# EAGLE design Stepper Motor Driver (EAGLE 6.4)
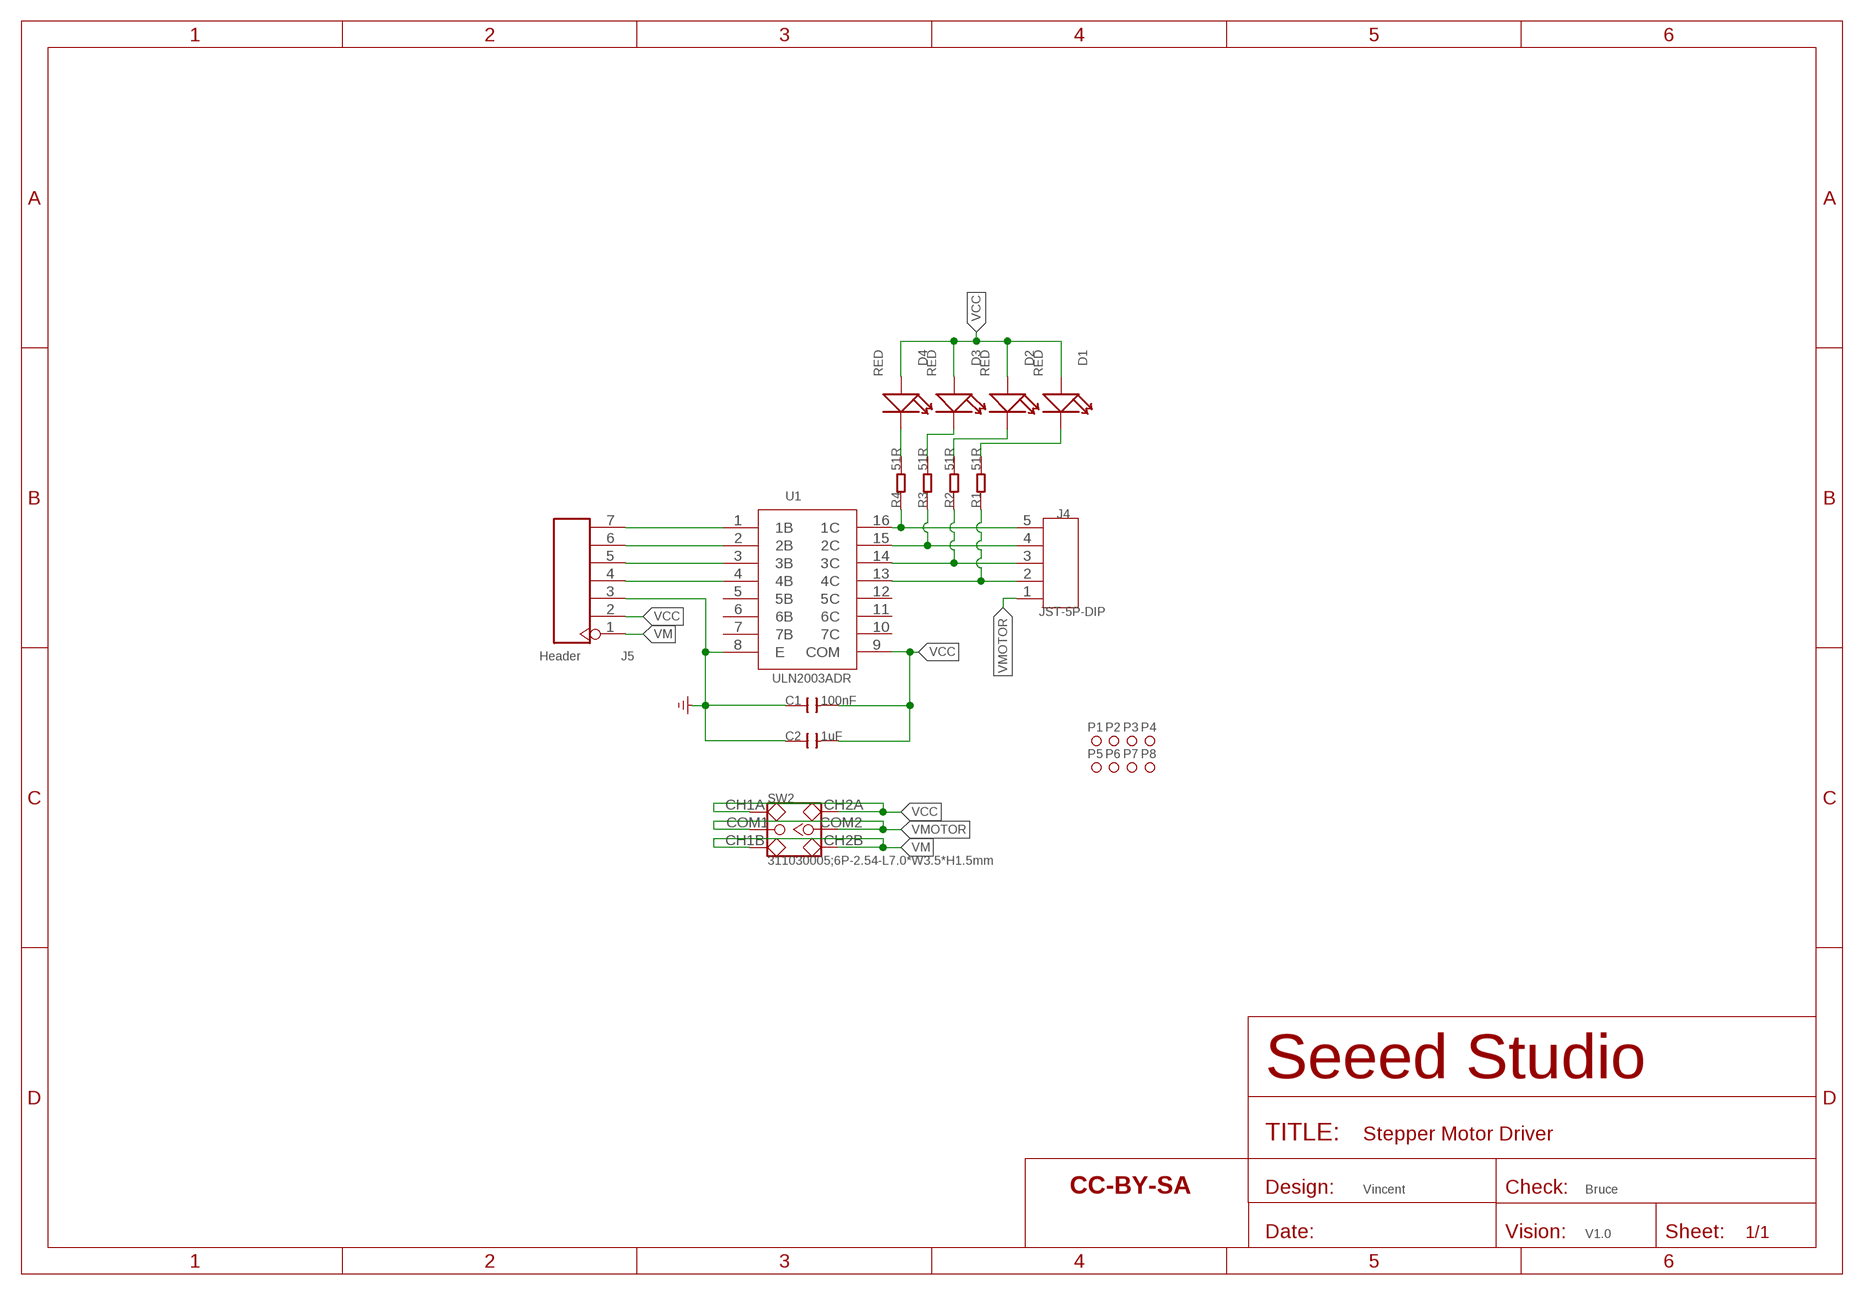
[diagram p0: schematic, sheet 1]

## Parts
C1  100nF  CAP-0603  [C0603]
C2  1uF  CAP-0603  [C0603]
D1  RED  LED'0603'  [LED-0603]
D2  RED  LED'0603'  [LED-0603]
D3  RED  LED'0603'  [LED-0603]
D4  RED  LED'0603'  [LED-0603]
J4  JST-5P-DIP  [JST5-2.54]
J5  Header  HEADER-7P  [H7-2.54]
P1  MARK-1.0'ANNULAR'  [ROUND-MARK-1.0]
P2  MARK-1.0'ANNULAR'  [ROUND-MARK-1.0]
P3  MARK-1.0'ANNULAR'  [ROUND-MARK-1.0]
P4  MARK-1.0'ANNULAR'  [ROUND-MARK-1.0]
P5  MARK-1.0'ANNULAR'  [ROUND-MARK-1.0]
P6  MARK-1.0'ANNULAR'  [ROUND-MARK-1.0]
P7  MARK-1.0'ANNULAR'  [ROUND-MARK-1.0]
P8  MARK-1.0'ANNULAR'  [ROUND-MARK-1.0]
R1  51R  RES-0603  [R0603]
R2  51R  RES-0603  [R0603]
R3  51R  RES-0603  [R0603]
R4  51R  RES-0603  [R0603]
SW2  311030005;6P-2.54-L7.0*W3.5*H1.5mm  SWITCH-2CH-6P-SMD  [SW6-2.54-SMD-7.0X3.5X1.5MM]
U1  ULN2003ADR  TRANSISTOR-ULN2003ADR  [SOIC16-1.27-10X3.9MM]
U$1  SEEEDSTUDIO-OPEN-SCH-FRAME  [SEEEDSTUDIO-PCB-FRAME]

## Nets
GND: C1.1 C2.1 J5.3 U1.8(E) ; supply symbol labelled GND_POWER
N$1: J4.4 R3.2 U1.15(2C)
N$2: J4.3 R2.2 U1.14(3C)
N$3: J5.4 U1.4(4B)
N$4: D4.- R4.1
N$5: J5.7 U1.1(1B)
N$6: J5.6 U1.2(2B)
N$7: J5.5 U1.3(3B)
N$9: D3.- R3.1
N$11: J4.5 R4.2 U1.16(1C)
N$12: D2.- R2.1
N$13: D1.- R1.1
N$14: J4.2 R1.2 U1.13(4C)
VCC: C1.2 C2.2 D1.+ D2.+ D3.+ D4.+ J5.2 SW2.CH1A SW2.CH2A U1.9(COM)
VM: J5.1 SW2.CH1B SW2.CH2B
VMOTOR: J4.1 SW2.COM1 SW2.COM2
Unconnected: U1.5(5B) U1.6(6B) U1.7(7B) U1.10(7C) U1.11(6C) U1.12(5C)

## Notes on the sheet
- Vincent | Bruce
- V1.0

## Library data of the parts
C1 C2 = Discrete-new:CAP: Ceramic Capacitors
D1-D4 = Discrete-new:LED
J4 = Connector-new:JST-5P-DIP
J5 = Connector-new:HEADER-7P
P1-P8 = Discrete-new:MARK-1.0; PARTNO: DNP
R1-R4 = Discrete-new:RES
SW2 = Discrete-new:SWITCH-2CH-6P: SW6-2.54-9.0X3.5X3.2+2.0MM:311010004;SW6-2.54-9.0X3.5X3.2-90D:311030004;SW6-2.54-SMD-7.0X3.5X1.5MM:311030005
U1 = IC-new:TRANSISTOR-ULN2003ADR: TRANSISTOR ARRAYS
U$1 = moudle-new:SEEEDSTUDIO-OPEN-SCH-FRAME

## Board
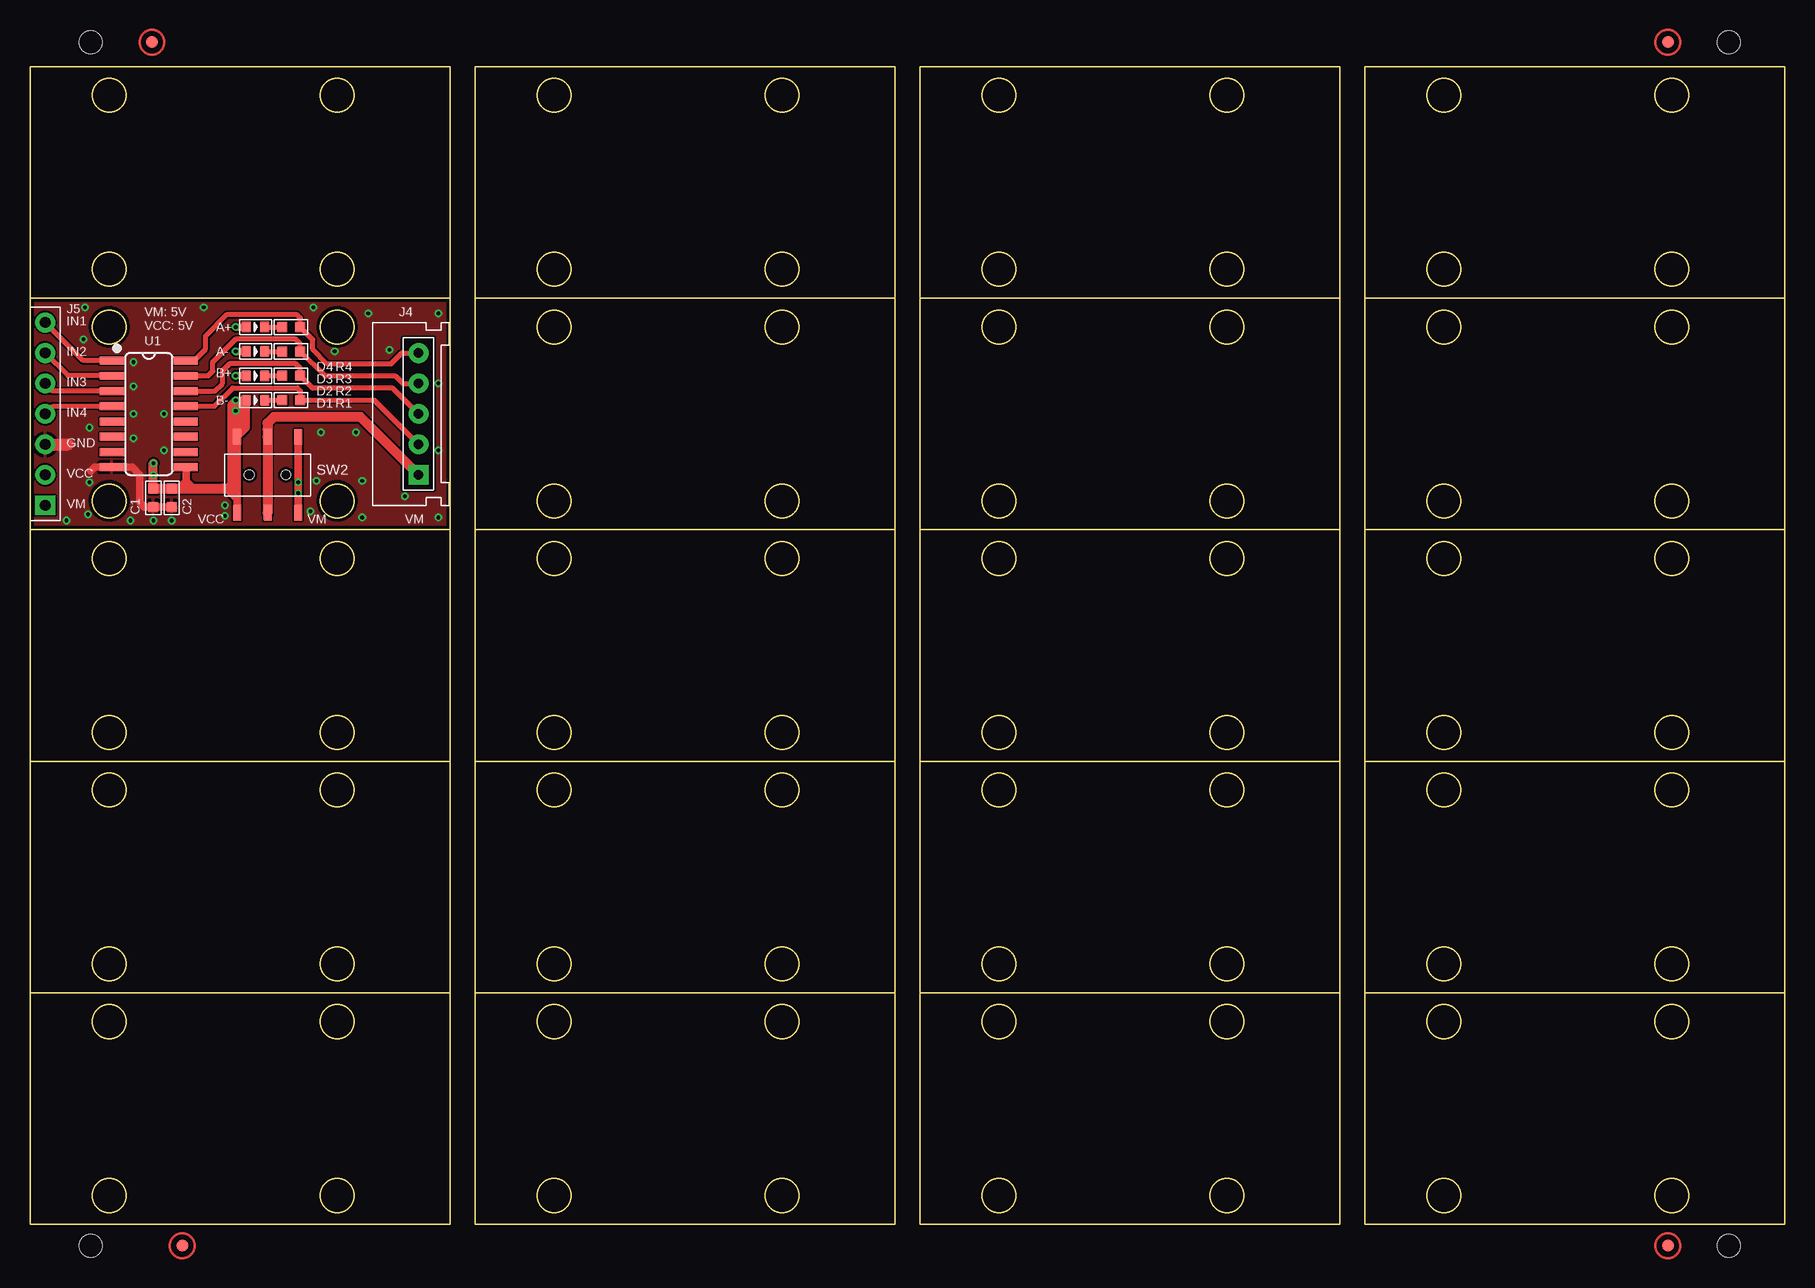
[diagram p1: board, top side]
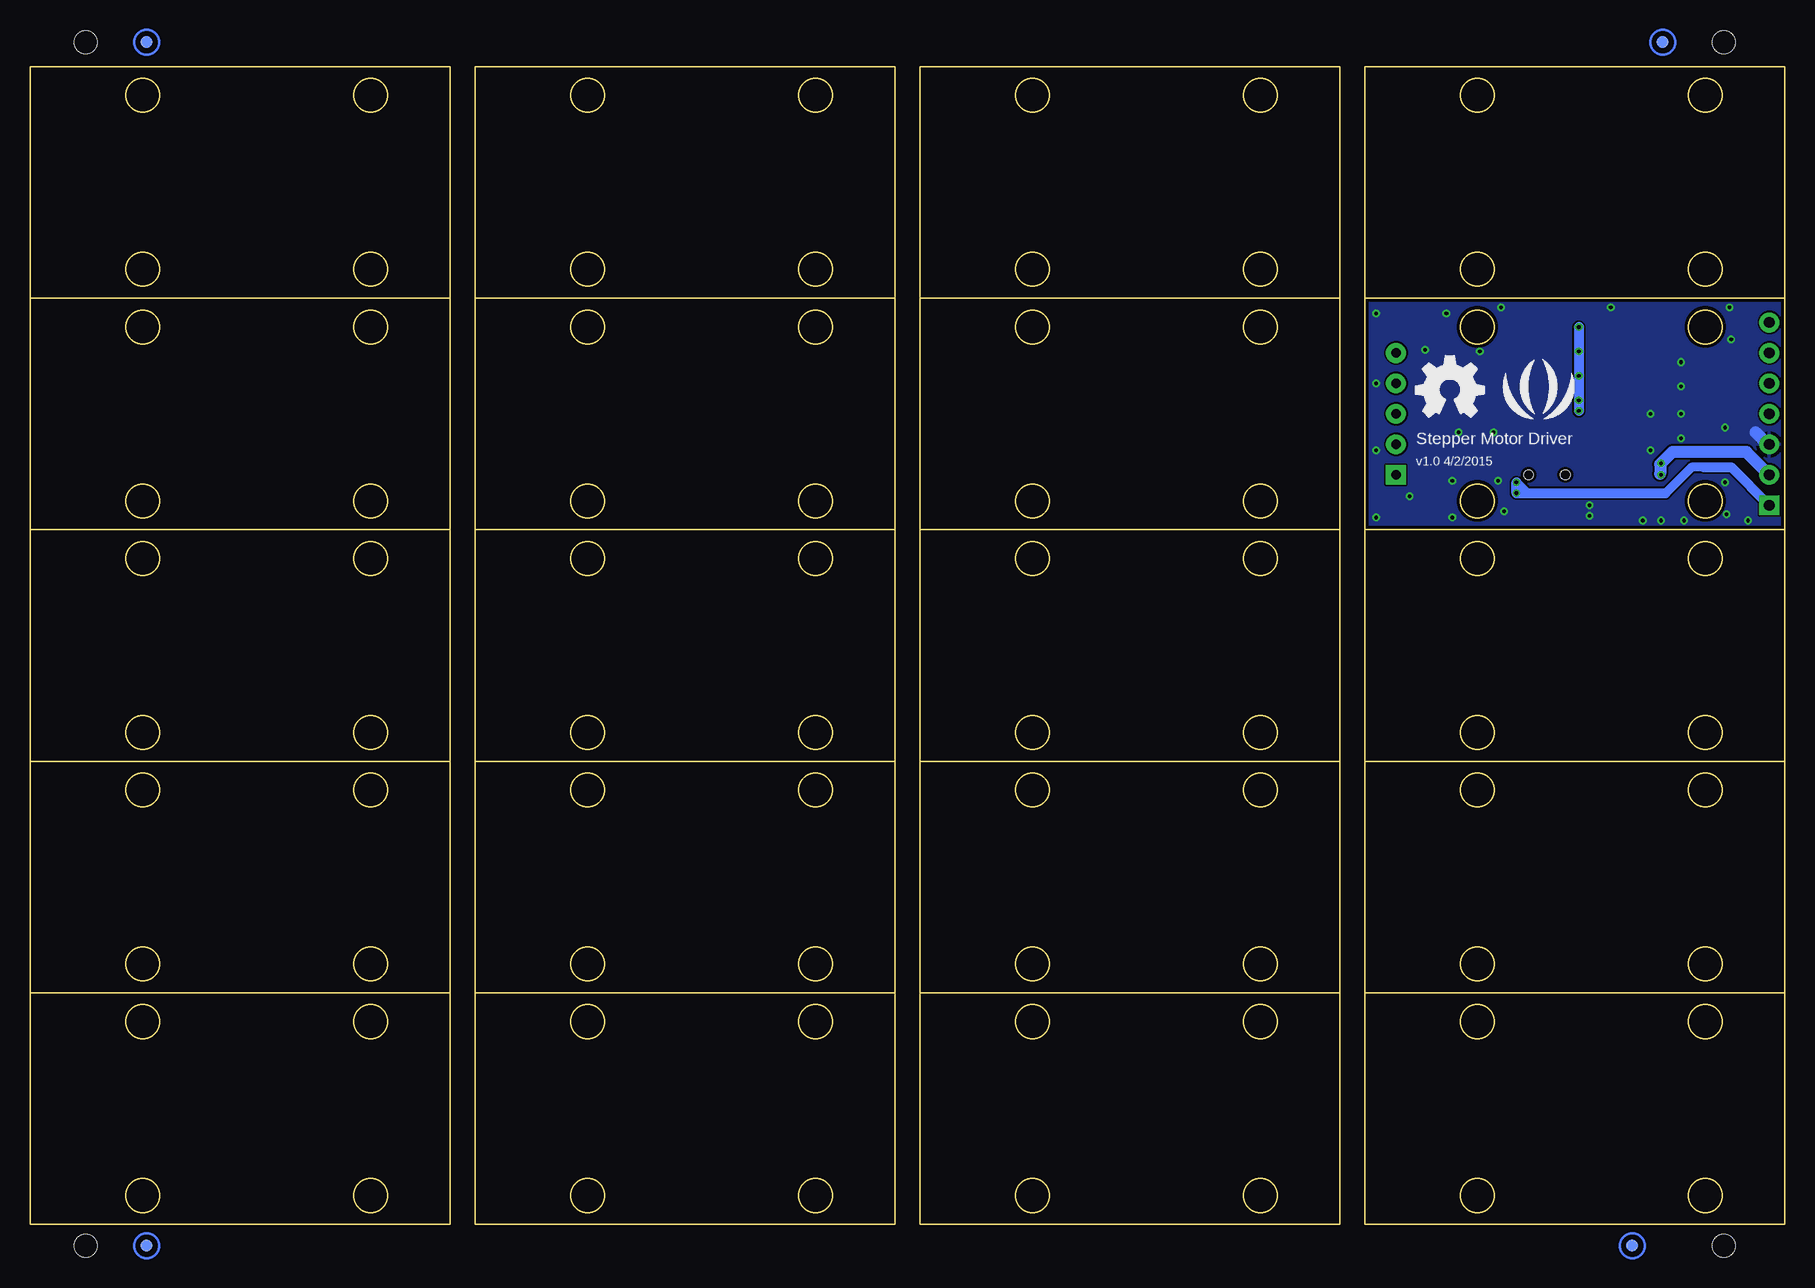
[diagram p2: board, bottom side, seen from below]

Size 146.25 x 96.52 mm. Coordinates in mm from the lower left corner, seen from the top.
Outline: 146.25,38.61 146.25,57.91 111.25,57.91 111.25,38.61 146.25,38.61
Outline: 146.25,38.6 111.25,38.6 111.25,19.3 146.25,19.3 146.25,38.6
Outline: 146.25,38.6 146.25,38.61
Outline: 35,96.52 0,96.52
Outline: 72.08,96.52 37.08,96.52
Outline: 109.17,96.52 74.17,96.52
Outline: 111.25,96.52 146.25,96.52 146.25,96.52
Outline: 146.25,96.52 111.25,96.52 111.25,77.22 146.25,77.22 146.25,96.52
Outline: 0,57.91 0,77.21 35,77.21 35,57.91 0,57.91
Outline: 0,38.61 0,57.91 35,57.91 35,38.61 0,38.61
Outline: 37.08,57.91 37.08,77.21 72.08,77.21 72.08,57.91 37.08,57.91
Outline: 37.08,38.61 37.08,57.91 72.08,57.91 72.08,38.61 37.08,38.61
Outline: 74.17,57.91 74.17,77.21 109.17,77.21 109.17,57.91 74.17,57.91
Outline: 74.17,38.61 74.17,57.91 109.17,57.91 109.17,38.61 74.17,38.61
Outline: 111.25,57.91 111.25,77.21 146.25,77.21 146.25,57.91 111.25,57.91
Outline: 0,19.3 0,38.6 35,38.6 35,19.3 0,19.3
Outline: 0,0 0,19.3 35,19.3 35,0 0,0
Outline: 37.08,19.3 37.08,38.6 72.08,38.6 72.08,19.3 37.08,19.3
Outline: 37.08,0 37.08,19.3 72.08,19.3 72.08,0 37.08,0
Outline: 74.17,19.3 74.17,38.6 109.17,38.6 109.17,19.3 74.17,19.3
Outline: 74.17,0 74.17,19.3 109.17,19.3 109.17,0 74.17,0
Outline: 111.25,0 111.25,19.3 146.25,19.3 146.25,0 111.25,0
Outline: 0,77.22 0,96.52 35,96.52 35,77.22 0,77.22
Outline: 37.08,77.22 37.08,96.52 72.08,96.52 72.08,77.22 37.08,77.22
Outline: 74.17,77.22 74.17,96.52 109.17,96.52 109.17,77.22 74.17,77.22
Outline: circle at 6.6,74.81 radius 1.4
Outline: circle at 25.6,74.81 radius 1.4
Outline: circle at 25.6,60.31 radius 1.4
Outline: circle at 6.6,60.31 radius 1.4
Outline: circle at 6.6,55.51 radius 1.4
Outline: circle at 25.6,55.51 radius 1.4
Outline: circle at 25.6,41.01 radius 1.4
Outline: circle at 6.6,41.01 radius 1.4
Outline: circle at 43.68,74.81 radius 1.4
Outline: circle at 62.68,74.81 radius 1.4
Outline: circle at 62.68,60.31 radius 1.4
Outline: circle at 43.68,60.31 radius 1.4
Outline: circle at 43.68,55.51 radius 1.4
Outline: circle at 62.68,55.51 radius 1.4
Outline: circle at 62.68,41.01 radius 1.4
Outline: circle at 43.68,41.01 radius 1.4
Outline: circle at 80.77,74.81 radius 1.4
Outline: circle at 99.77,74.81 radius 1.4
Outline: circle at 99.77,60.31 radius 1.4
Outline: circle at 80.77,60.31 radius 1.4
Copper layers (1*16): Top 0.035mm / dielectric 1.5mm / Bottom 0.035mm
Design rules "SeeedStudio_2layer_DRU_no_angle_20140221 *": minimum track width 1mil, minimum drill 12mil, track to track 6mil, track to pad 10mil, pad to pad 10mil, via to via 6mil, smd to smd 0mil, copper to edge 10mil, drill to drill 10mil, minimum pad ring 10mil, minimum via ring 6mil, stop-mask expansion 2mil, vias tented up to drill 25mil, thermal gap 10mil
Holes 1.91 mm at 5.08,98.55 141.6,98.55 141.6,-1.78 5.08,-1.78

### Footprints (pad centres in the part's own frame; a part is rotated, then mirrored left to right if it is on the bottom)
C0603 = smd 0.889 x 0.889: 1 0,0.762; 2 0,-0.762
LED-0603 = smd 0.762 x 0.889: + -0.762,0; - 0.762,0
JST5-2.54 = drill 0.813 pad 1.651 square: 1 5.08,0 | drill 0.813 pad 1.651: 2 2.54,0; 3 0,0; 4 -2.54,0; 5 -5.08,0
H7-2.54 = drill 0.889 pad 1.651 square: 1 0,7.62 | drill 0.889 pad 1.651: 2 0,5.08; 3 0,2.54; 4 0,0; 5 0,-2.54; 6 0,-5.08; 7 0,-7.62
ROUND-MARK-1.0 = smd 1.016 x 1.016: P$1 0,0
R0603 = smd 0.889 x 0.889: 1 0,0.762; 2 0,-0.762
SW6-2.54-SMD-7.0X3.5X1.5MM = smd 1.27 x 0.635: CH1A -3.175,2.54; CH1B -3.175,-2.54; CH2A 3.175,2.54; CH2B 3.175,-2.54; COM1 -3.175,0; COM2 3.175,0 | hole 0.813: 0,1.524; 0,-1.524
SOIC16-1.27-10X3.9MM = smd 0.66 x 2.032: 1 -4.445,-3.073; 2 -3.175,-3.073; 3 -1.905,-3.073; 4 -0.635,-3.073; 5 0.635,-3.073; 6 1.905,-3.073; 7 3.175,-3.073; 8 4.445,-3.073; 9 4.445,3.073; 10 3.175,3.073; 11 1.905,3.073; 12 0.635,3.073; 13 -0.635,3.073; 14 -1.905,3.073; 15 -3.175,3.073; 16 -4.445,3.073

### Placement (x,y rotation side)
C1  10.29,60.58 180 top
C2  11.81,60.58 180 top
D1  18.8,68.71 0 top
D2  18.8,70.74 0 top
D3  18.8,72.77 0 top
D4  18.8,74.8 0 top
J4  32.38,67.56 270 top
J5  1.27,67.56 180 top
P1  10.16,98.55 0 top
P2  10.16,98.55 0 bottom
P3  12.7,-1.78 0 top
P4  12.7,-1.78 0 bottom
P5  136.53,-1.78 0 top
P6  136.53,-1.78 0 bottom
P7  136.53,98.55 0 top
P8  136.53,98.55 0 bottom
R1  21.77,68.71 90 top
R2  21.77,70.74 90 top
R3  21.77,72.77 90 top
R4  21.77,74.8 90 top
SW2  19.81,62.48 90 top
U1  9.91,67.56 270 top
U$1  1.65,-15.62 0 top  (outside the outline)
U$7  [SEEED-SILK-280*268MIL]  20.5,68.83 0 bottom
U$8  [OSHW_FILLX200_NOTEXT]  30.73,67.31 0 bottom

### Tracks (layer width: path | path; a pad name or v marks a point on that pad's centre or on a via)
GND  (via drill 0.3 pad 0.64)
  Top 0.635: C2.1 C1.1 9.53,59.82 9.14,60.2 9.14,62.48 8.51,63.12 U1.8 5.41,63.12 5.08,62.79
  Top 1.016: J5.3 3.17,65.02
  Bottom 1.016: J5.3 1.4,65.02 2.41,66.04
  other vias: 8.64,71.88 8.64,69.85 8.64,65.53 11.18,64.52 8.64,67.56 11.18,67.56 23.62,76.45 28.19,75.95 34.04,75.95 4.83,59.18 8.38,58.67 34.04,58.93 27.69,58.93 34.04,64.52 34.04,70.1 4.45,73.79 4.95,66.42 27.69,61.98 31.24,60.71 23.88,61.98 23.37,59.44 16.26,59.05 10.29,58.67 11.81,58.67 4.57,76.45 25.4,72.77 16.26,59.94 27.18,66.04 24.26,66.04 29.97,72.9 14.48,76.45 4.95,61.85 3.05,58.67
  pour Top: -1.27,78.23 36.2,78.23 36.2,57.15 -1.27,57.15
  pour Bottom: -1.27,78.87 36.2,78.87 36.2,57.78 -1.27,57.78
N$1
  Top 0.254: U1.15 13.59,70.74
  Top 0.406: J4.4 31.09,70.1 30.48,70.71 24.59,70.71 R3.2 22.53,73.41 22.15,73.79 17.14,73.79 15.24,71.88 15.24,71.12 14.86,70.74 13.59,70.74
N$2
  Top 0.254: U1.14 13.46,69.47
  Top 0.406: J4.3 30.25,69.7 23.57,69.7 R2.2 22.53,71.37 22.15,71.75 16.64,71.75 16.05,71.17 16.05,70.1 15.42,69.47 13.46,69.47
N$3
  Top 0.406: J5.4 1.91,68.2 U1.4
N$4
  Top 0.406: D4.- R4.1
N$5
  Top 0.406: U1.1 4.45,72.01 J5.7
N$6
  Top 0.406: U1.2 3.17,70.74 J5.6
N$7
  Top 0.406: U1.3 1.91,69.47 J5.5
N$8
  cutout Top: 31.11,73.91 33.66,73.91 33.66,61.21 31.11,61.21
N$9
  Top 0.406: D3.- R3.1
N$11
  Top 0.254: U1.16
  Top 0.406: J4.5 30.99,72.64 30.07,71.73 24.79,71.73 23.57,72.95 23.57,73.76 R4.2 22.53,75.56 22.28,75.82 16.38,75.82 14.63,74.07 14.63,72.97 13.67,72.01 U1.16
N$12
  Top 0.406: D2.- R2.1
N$13
  Top 0.406: D1.- R1.1
N$14
  Top 0.254: U1.13
  Top 0.406: J4.2 28.7,68.71 R1.2 22.53,69.47 22.28,69.72 16.89,69.72 15.37,68.2 U1.13
VCC  (via drill 0.3 pad 0.64)
  Top 0.635: 17.65,68.71 D1.+ 18.03,66.42 SW2.CH2A 17.27,61.34 | 17.65,68.71 17.27,68.71 | 17.27,68.71 v17.14,68.71 16.76,68.33 16.76,61.72 | 18.03,70.87 D2.+ v17.14,70.74 | 18.03,72.64 D3.+ v17.14,72.77 | D4.+ v17.14,74.8 | U1.9 13.01,63.09 13.01,61.98 | SW2.CH1A 17.27,61.34 | C1.2 10.54,61.34 C2.2 13.01,61.34 13.01,61.98 | 16.38,61.34 16.76,61.34 | 16.76,61.34 16.89,61.34 17.27,61.34 | 16.76,61.34 17.14,61.72 | 16.76,61.34 17.27,60.83 | 16.38,61.34 16.76,61.72 | 16.76,61.72 17.14,62.1 | 16.13,61.34 16.38,61.34 | 16.38,61.34 17.14,60.58 | 17.27,68.71 17.27,65.91 | 17.65,68.71 17.53,68.58 17.53,66.17 | 13.01,61.98 12.39,61.37 12.19,61.37 | 13.01,61.98 13.61,61.37
  Top 0.762: C1.2 v10.29,62.48 v10.29,63.45
  Top 0.813: 10.54,61.34 13.01,61.34 16.13,61.34 16.89,61.34
  Bottom 0.813: v17.14,74.8 v17.14,72.77 v17.14,70.74 v17.14,68.71 v17.14,67.82
  Bottom 1.016: J5.2 3.18,64.39 9.35,64.39 v10.29,63.45 10.36,63.37 10.36,62.59
VM  (via drill 0.3 pad 0.51)
  Top 0.635: SW2.CH2B v22.35,60.96 SW2.CH1B 22.35,60.32
  Bottom 0.635: v22.35,61.85 22.23,61.85 21.46,61.09
  Bottom 0.762: 6.73,63.12 7.75,63.12 9.91,60.96
  Bottom 0.813: v22.35,61.85 v22.35,60.96 9.91,60.96 | 6.73,63.12 4.45,63.12 J5.1
VMOTOR
  Top 0.813: J4.1 27.56,67.31 20.32,67.31 19.81,66.8 19.81,66.29 SW2.COM2 | SW2.COM2 | SW2.COM2 SW2.COM1

### Text on the board
tPlace: VM: 5V | IN1 | VCC: 5V | A+ | IN2 | A- | B+ | IN3 | B- | IN4 | GND | VCC | VM | VCC | VM | VM
bPlace: Stepper Motor Driver | v1.0 4/2/2015